# Altium schematic sheet Power_supply.SchDoc
size A4
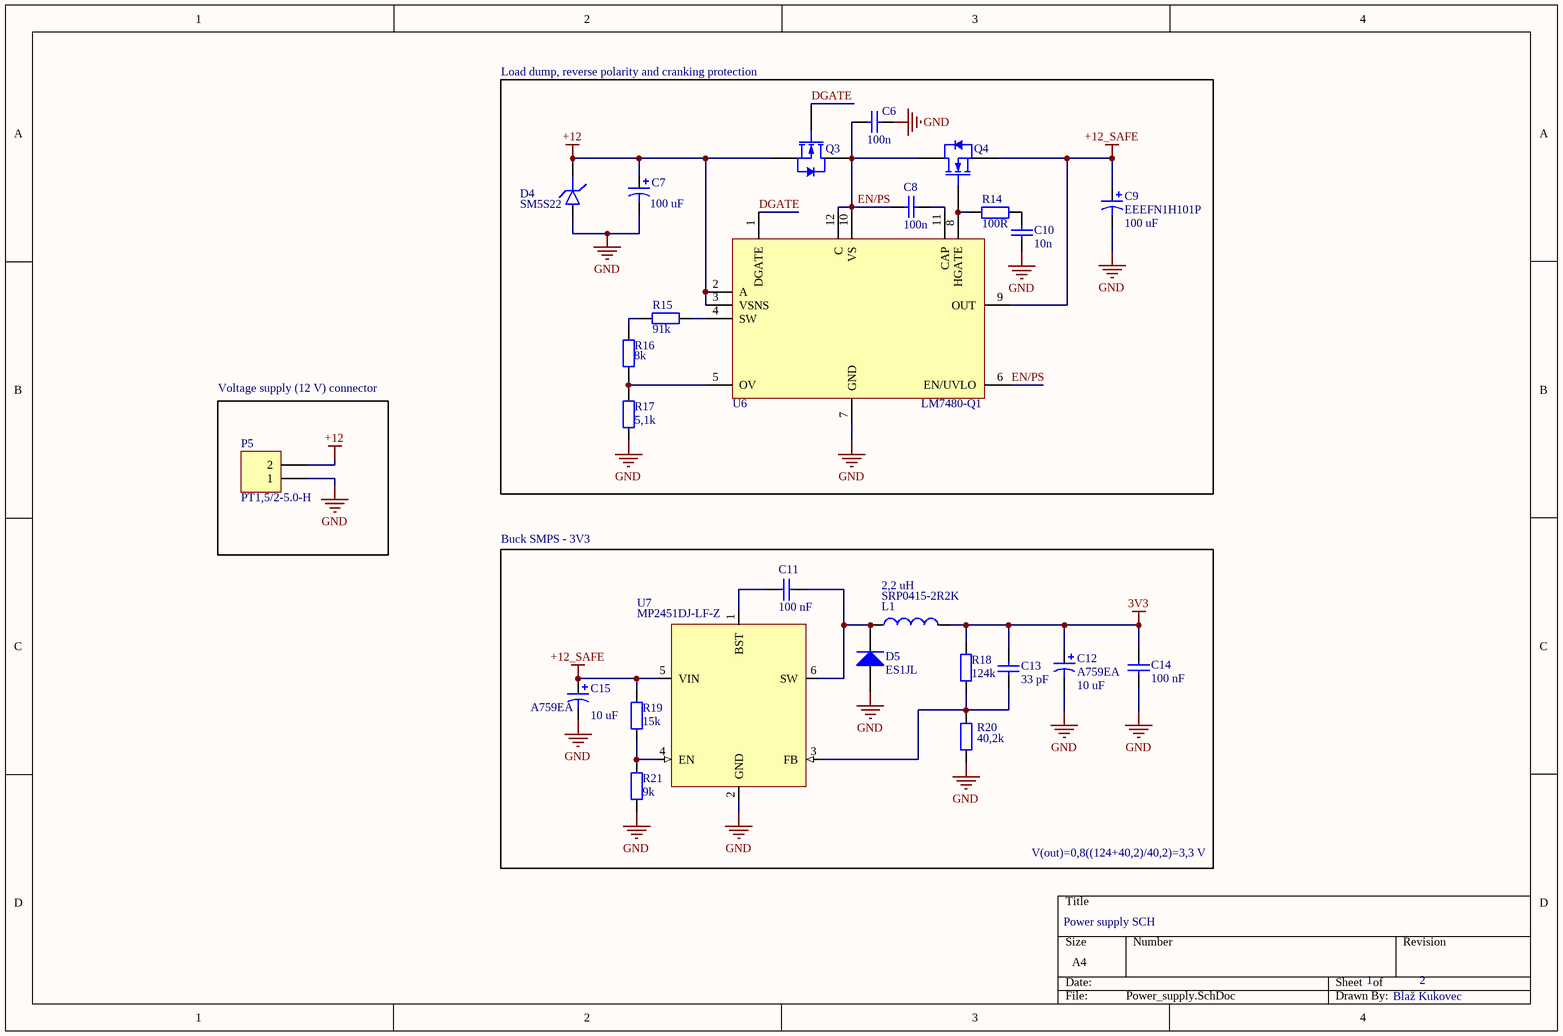
[diagram p0: Power_supply.SchDoc]

## Parts
C6  value 100n  [C0603[1608]]  (hidden comment: Cap)
C7  value 100 uF  [CAP_FN_F_PAN]  (hidden comment: EEEFN1H101P)
C8  value 100n  [C0603[1608]]  (hidden comment: Cap)
C9  EEEFN1H101P  value 100 uF  [CAP_FN_F_PAN]
C10  value 10n  [C0603[1608]]  (hidden comment: Cap)
C11  value 100 nF  [C0603[1608]]  (hidden comment: Cap)
C12  A759EA  value 10 uF  [A759EA]
C13  value 33 pF  [C0603[1608]]  (hidden comment: Cap)
C14  value 100 nF  [C0603[1608]]  (hidden comment: Cap)
C15  A759EA  value 10 uF  [A759EA]
D4  SM5S22  [DO-218AB_SM_VIS]
D5  ES1JL  [Sub-SMA]
L1  SRP0415-2R2K  value 2,2 uH  [SRP0415]
P5  PT1,5/2-5.0-H  [PT1,5/2-5.0-H]
Q3  BUK7Y4R8-60EX  [SOT669]  (value not drawn)
Q4  BUK7Y4R8-60EX  [SOT669]  (value not drawn)
R14  value 100R  [0603R-GENERIC]  (hidden comment: Res)
R15  value 91k  [R0603[1608]]  (hidden comment: Res)
R16  value 8k  [R0603[1608]]  (hidden comment: Res)
R17  value 5,1k  [R0603[1608]]  (hidden comment: Res)
R18  value 124k  [0603R-GENERIC]  (hidden comment: Res)
R19  value 15k  [R0603[1608]]  (hidden comment: Res)
R20  value 40,2k  [0603R-GENERIC]  (hidden comment: Res)
R21  value 9k  [R0603[1608]]  (hidden comment: Res)
U6  LM7480-Q1  [WSON12]
U7  MP2451DJ-LF-Z  [TSOT-23-6]

## Blocks framed on the sheet
Load dump, reverse polarity and cranking protection: C6-C10 D4 Q3 Q4 R14-R17 U6
Voltage supply (12 V) connector: P5

## Nets
3V3: C12.1 C13.2 C14.2 L1.2 R18.1
+12: C7.1 D4.K P5.2 Q3.3(S) U6.2(A) U6.3(VSNS)
+12_SAFE: C9.1 C15.1 Q4.3(S) R19.2 U6.9(OUT) U7.5(VIN)
GND: C6.1 C7.2 C9.2 C10.1 C12.2 C14.1 C15.2 D4.A D5.1(A) P5.1 R17.1 R20.1 R21.1 U6.7(GND) U7.2(GND)
DGATE: Q3.1(G) U6.1(DGATE)
EN/PS: C6.2 C8.1 Q3.2(D) Q4.2(D) U6.6(EN/UVLO) U6.10(VS) U6.12(C)
NetC8_2: C8.2 U6.11(CAP)
NetC10_2: C10.2 R14.2
NetC11_1: C11.1 D5.2(K) L1.1 U7.6(SW)
NetC11_2: C11.2 U7.1(BST)
NetC13_1: C13.1 R18.2 R20.2 U7.3(FB)
NetQ4_1: Q4.1(G) R14.1 U6.8(HGATE)
NetR15_1: R15.1 U6.4(SW)
NetR15_2: R15.2 R16.2
NetR16_1: R16.1 R17.2 U6.5(OV)
NetR19_1: R19.1 R21.2 U7.4(EN)

## Notes on the sheet
- Buck SMPS - 3V3
- V(out)=0,8((124+40,2)/40,2)=3,3 V
- Power supply SCH
- 1
- 2
- Blaž Kukovec

## Library data of the parts
C6 C8 C10 C11 C13 C14 = Cap: Capacitor; ComponentLink1Description: Supplierlink; ComponentLink2Description: Datasheet
C7 C9 = EEEFN1H101P: SMD Aluminium Electrolytic Capacitor, Radial Can - SMD, 100 µF, 50 V, 0.34 ohm; PacketDescription: TH; ComponentLink1Description: SupplierLink; ComponentLink1URL: https://si.farnell.com/panasonic/eeefn1h101p/cap-100uf-50v-alu-elec-smd/dp/3386217; ComponentLink2Description: Datasheet; ComponentLink2URL: https://www.farnell.com/datasheets/2939503.pdf; Supplier1: Farnell; SupplierPartNumber1: 3386217
C12 C15 = A759EA106M1JAAE060: A759EA106M1JAAE060 - Capacitor - 10 µF - 63 V - Low ESR (60m); PacketDescription: TH; ComponentLink1Description: SupplierLink; ComponentLink1URL: https://si.farnell.com/kemet/a759ea106m1jaae060/cap-10uf-63v-alu-polymer-radial/dp/4071156; ComponentLink2Description: Datasheet; ComponentLink2URL: https://content.kemet.com/datasheets/KEM_A4072_A759.pdf; Supplier1: Farnell; SupplierPartNumber1: 4071156
D4 = SM5S22ATHE3/I: ESD Suppressors / TVS Diodes 5W,22V 5%,SMD PAR AEC-Q101 Qualified; ComponentLink1Description: Supplierlink; PackageDescription: PowerDI123; ComponentLink1URL: https://eu.mouser.com/ProductDetail/Vishay-General-Semiconductor/SM5S22ATHE3-I?qs=Vcr9%2FL0R50gQwdAZT2MpLw%3D%3D; ComponentLink2Description: Datasheet; ComponentLink2URL: https://www.vishay.com/docs/87609/sm5s10atthrusm5s36at.pdf; Supplier1: Mouser; SupplierPartNumber1: 78-SM5S22ATHE3/I
D5 = ES1JL: Ultrafast Diode; ComponentLink1Description: Supplierlink; PackageDescription: Sub SMA; ComponentLink1URL: https://www.tme.eu/sl/details/es1jl/univerzalne-smd-diode/taiwan-semiconductor/; ComponentLink2Description: Datasheet; ComponentLink2URL: https://www.tme.eu/sl/Document/6e3ed172b8ef57eec12ad172948b8283/ES1JL-DTE.pdf; Supplier1: TME; SupplierPartNumber1: https://www.tme.eu/sl/details/es1jl/univerzalne-smd-diode/taiwan-semiconductor/
L1 = SRP0415-2R2K: Power Inductor (SMD), 2.2 µH, 4.2 A, Shielded, 6.5 A, SRP0415; ComponentLink1Description: Supplierlink; PackageDescription: 4,1 x 4,4 mm; ComponentLink1URL: https://si.farnell.com/bourns/srp0415-2r2k/inductor-2-2uh-shielded-4-2a/dp/3410557?st=srp0415-2r2k; ComponentLink2Description: Datasheet; ComponentLink2URL: http://www.farnell.com/datasheets/1780639.pdf?_ga=1.11763974http://www.farnell.com/datasheets/1870377.pdf?_ga=2.97039455.1713077709.1510607325-537448299.1510088633&_gac=1.187392858.1510611497.CjwKCAiAoqXQBRA8EiwAIIOWsuqxOSeUt0rc_qHWWY-BiEXPlEM73fxauWSkJ-z_Lq9BZTEckF83wRoCiNIQAvD_BwE5.938531117.1476279422; Supplier1: Farnell; SupplierPartNumber1: 3410557
P5 = PT1,5/2-5.0-H: Wire-To-Board Terminal Block, 5 mm, 2 Ways, 1.5 mm²; ComponentLink1Description: SupplierLink; ComponentLink1URL: https://si.farnell.com/phoenix-contact/pt1-5-2-5-0-h/terminal-block-wire-to-brd-2pos/dp/1793674?st=pt1,5; ComponentLink2Description: Datasheet; ComponentLink2URL: http://www.farnell.com/datasheets/2325505.pdf; Supplier1: Farnell; SupplierPartNumber1: 1793674
Q3 Q4 = BUK7Y4R8-60EX: Power MOSFET, N Channel, 60 V, 100 A, 0.0029 ohm, LFPAK56, Surface Mount; ComponentLink1Description: Supplierlink; PackageDescription: SOT669; ComponentLink1URL: https://si.farnell.com/nexperia/buk7y4r8-60ex/mosfet-aecq101-n-ch-60v-100a-lfpak56/dp/3439679?st=buk7y4r8-60e; ComponentLink2Description: Datasheet; ComponentLink2URL: https://4donline.ihs.com/images/VipMasterIC/IC/NEXP/NEXP-S-A0003060256/NEXP-S-A0003059997-1.pdf?hkey=6D3A4C79FDBF58556ACFDE234799DDF0; Supplier1: Farnell; SupplierPartNumber1: 3439679
R14-R21 = Res: Resistor; ComponentLink1Description: Supplierlink; ComponentLink2Description: Datasheet
U6 = LM7480-Q1: Power Management Specialised - PMIC 3-V to 65-V, automotive ideal diode controller driving back to back NFETs 12-WSON -40 to 125; ComponentLink1Description: Supplierlink; PackageDescription: WSON-12; ComponentLink1URL: https://eu.mouser.com/ProductDetail/Texas-Instruments/LM74801QDRRRQ1?qs=zW32dvEIR3uHxOfYWHY8FQ%3D%3D; ComponentLink2Description: Datasheet; ComponentLink2URL: https://www.ti.com/lit/ds/symlink/lm7480-q1.pdf?HQS=dis-mous-null-mousermode-dsf-pf-null-wwe&ts=1693805776578&ref_url=https%253A%252F%252Fwww.mouser.cn%252F; Supplier1: Mouser; SupplierPartNumber1: 595-LM74801QDRRRQ1
U7 = MP2451DJ-LF-Z: DC-DC Switching Buck (Step Down) Regulator, 3.3V-36V in, 800mV to 28.8V out, 600mA, 2MHz, TSOT-23-6; ComponentLink1Description: Supplierlink; PackageDescription: TSOT-23-6; ComponentLink1URL: https://si.farnell.com/monolithic-power-systems-mps/mp2451dj-lf-z/dc-dc-conv-sync-buck-2mhz-125degc/dp/3357997; ComponentLink2Description: Datasheet; ComponentLink2URL: https://www.farnell.com/datasheets/2914802.pdf; Supplier1: Farnell; SupplierPartNumber1: 3357997